# Altium schematic sheet DSI_LCD.SchDoc: DSI_LCD_connector
size A4; Date: 29-OCT-2015; Author: A.B; CompanyName: STMicroelectronics; Organization: MCD/TOOLS/GNB; Address1: 12, Rue Jules HOROWITZ; Address2: 38019 Grenoble; Address3: FRANCE; DocumentNumber: MB1272; Revision: A-01; SheetNumber: 8; SheetTotal: 15; Project: STM32MP15-DISCO PI
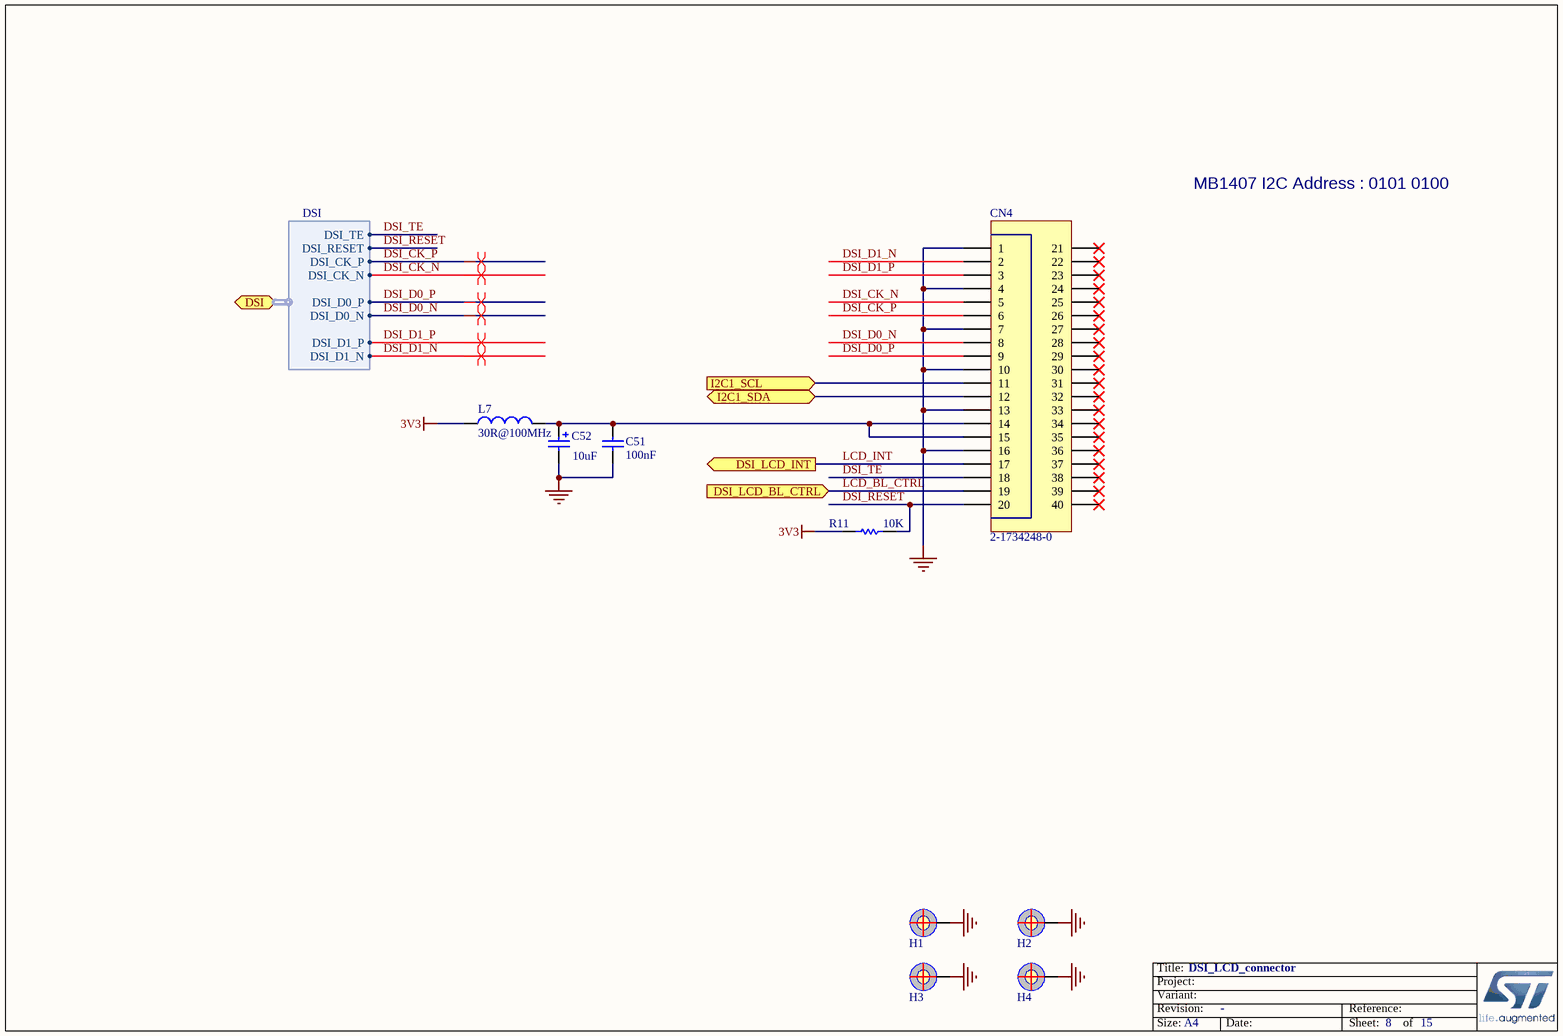
[diagram p0: DSI_LCD.SchDoc]

## Parts
C51  value 100nF  [C0402]
C52  value 10uF  [CPOL_TAJ-A_1206_H180]
CN4  value 2-1734248-0  [CON_TE-CONNECTIVITY_2-1734248-0]
H1  (no value)  [PTH_M1261-3005-N_3P5X6_M3_H14]  (no BOM)
H2  (no value)  [PTH_M1261-3005-N_3P5X6_M3_H14]  (no BOM)
H3  (no value)  [PTH_M1261-3005-N_3P5X6_M3_H14]  (no BOM)
H4  (no value)  [PTH_M1261-3005-N_3P5X6_M3_H14]  (no BOM)
L7  value 30R@100MHz  [L0603]  (hidden comment: BEAD)
R11  value 10K  [R0402]

## Ports
DSI (harness DSI), DSI_LCD_BL_CTRL (in), DSI_LCD_INT (out), I2C1_SCL (in), I2C1_SDA (bidir)

## Harnesses
DSI: DSI_CK_P, DSI_CK_N, DSI_D0_P, DSI_D0_N, DSI_D1_P, DSI_D1_N, DSI_TE, DSI_RESET

## Nets
3V3: L7.1 R11.1
GND: C51.1 C52.2 CN4.1 CN4.4 CN4.7 CN4.10 CN4.13 CN4.16 H1.1 H2.1 H3.1 H4.1
DSI_CK_N: CN4.5 ; port DSI.DSI_CK_N
DSI_CK_P: CN4.6 ; port DSI.DSI_CK_P
DSI_D0_N: CN4.8 ; port DSI.DSI_D0_N
DSI_D0_P: CN4.9 ; port DSI.DSI_D0_P
DSI_D1_N: CN4.2 ; port DSI.DSI_D1_N
DSI_D1_P: CN4.3 ; port DSI.DSI_D1_P
DSI_RESET: CN4.20 R11.2 ; port DSI.DSI_RESET
DSI_TE: CN4.18 ; port DSI.DSI_TE
I2C1_SCL: CN4.11 ; port I2C1_SCL
I2C1_SDA: CN4.12 ; port I2C1_SDA
LCD_BL_CTRL: CN4.19 ; port DSI_LCD_BL_CTRL
LCD_INT: CN4.17 ; port DSI_LCD_INT
NetC51_2: C51.2 C52.1 CN4.14 CN4.15 L7.2

Not connected (* = marked no-connect by the designer): CN4 21* 22* 23* 24* 25* 26* 27* 28* 29* 30* 31* 32* 33* 34* 35* 36* 37* 38* 39* 40*

## Layout directives
differential pair: DSI_CK_N, DSI_CK_P, DSI_D0_N, DSI_D0_P, DSI_D1_N, DSI_D1_P

## Notes on the sheet
- MB1407 I2C Address : 0101 0100
- Title:
- Project:
- Size:
- Revision:
- Variant:
- A4
- -
- Date:
- Reference:
- Sheet:
- of

## Library data of the parts
C51 = MCD-00006: Capacitor,100nF,16V,X7R,10%,0402; Manufacturer_Part_Number: CC0402KRX7R7BB104; Manufacturer: YAGEO; Alternate_Manufacturer: MURATA; Alternate_Manufacturer_Part_Number: GCM155R71C104KA55D; Provided_By: SUBCO; Initial_Board_Reference: mb1274; Internal_Part_Number: MCD-00006; ComponentLink1Description: Datasheet; ECCN_US: n/a; ECCN_EU: n/a; Status: Released; Part_Type: Capacitor; Package: C0402; ComponentLink1URL: http://tunmcdsvn.tun.st.com/Component_Datasheet_Library/Trunk/Capacitors/Yageo_Multilayer_Capacitor_X7R_series_100pF_to_22uF
C52 = MCD-00199: Polarized Capacitor,10uF,16V,10%,typeA; Manufacturer_Part_Number: TAJA106K016R; Manufacturer: AVX; Provided_By: SUBCO; ECCN_US: EAR99; ECCN_EU: NEC; Revision: July-2002: Re-released for DXP Platform.; Internal_Part_Number: MCD-00199; Status: Footprint available; Part_Type: Capacitor; ComponentLink1Description: Datasheet; ComponentLink1URL: http://tunmcdsvn.tun.st.com/Component_Datasheet_Library/Trunk/Capacitors/AVX_Capacitor_TAJ-series; Package: C1206
CN4 = MCD-01013: Socket ,TEConn,FCC/FPC, 20pins, 1.0mm,SMT, ZIF Receptacle; Part_Type: Connector; Manufacturer: TE CONNECTIVITY; Provided_By: SUBCO; Initial_Board_Reference: MB1272; Internal_Part_Number: MCD-01013; Status: Checked; Manufacturer_Part_Number: 2-1734248-0; ComponentLink1Description: Datasheet; ComponentLink1URL: http://tunmcdsvn.tun.st.com/Component_Datasheet_Library/Trunk/Connectors/TE_connectivity_FPC_1mm_vertical_2-1734248-0/TEconnectivity_FPC_1mm_vertical_2-1734248-0.pdf; ECCN_US: n/a; ECCN_EU: n/a
H1-H4 = MCD-00035: POSITION HOLE C6D3R5; Part_Type: Mechanical; Initial_Board_Reference: mb1274; Internal_Part_Number: MCD-00035; ECCN_US: n/a; ECCN_EU: n/a; Status: Released; Provided_By: n/a; ComponentLink1Description: Datasheet; Manufacturer: n/a; Manufacturer_Part_Number: n/a
L7 = MCD-00046: SMD Chip ferrite bead, 30R@100MHz +/-30%, 5A, 10mohm DC, S (Standard) material, 0603, T=0.8mm; Part_Type: Inductor; Manufacturer_Part_Number: MPZ1608S300A; Manufacturer: TDK; Provided_By: SUBCO; Initial_Board_Reference: MB1274; Internal_Part_Number: MCD-00046; Status: Released; ComponentLink1Description: Datasheet; ComponentLink1URL: http://tunmcdsvn.tun.st.com/Component_Datasheet_Library/Trunk/Inductors/TDK_Beads_MPZ-series; ECCN_US: n/a; ECCN_EU: n/a
R11 = MCD-00053: Resistor,10K,0402,1%,1/16W; Manufacturer_Part_Number: RC0402FR-0710KL; Manufacturer: YAGEO; Provided_By: SUBCO; Initial_Board_Reference: mb1274; Internal_Part_Number: MCD-00053; ComponentLink1Description: Datasheet; ECCN_US: n/a; ECCN_EU: n/a; Status: Released; Part_Type: Resistor; ComponentLink1URL: http://tunmcdsvn.tun.st.com/Component_Datasheet_Library/Trunk/Resistors/Yageo_Resistor_RC0402-series; Package: R0402